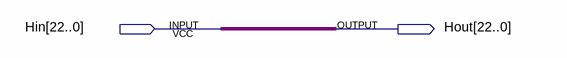
[diagram p0: schematic sheet]
// Quartus schematic ConvertBus23bit.bdf as structural Verilog: 0 symbols, 2 pins
module ConvertBus23bit (
  input  [22:0] Hin,
  output [22:0] Hout
);


  assign Hout = Hin;
endmodule
